# Altium project Thunderscope-E.PrjPCB
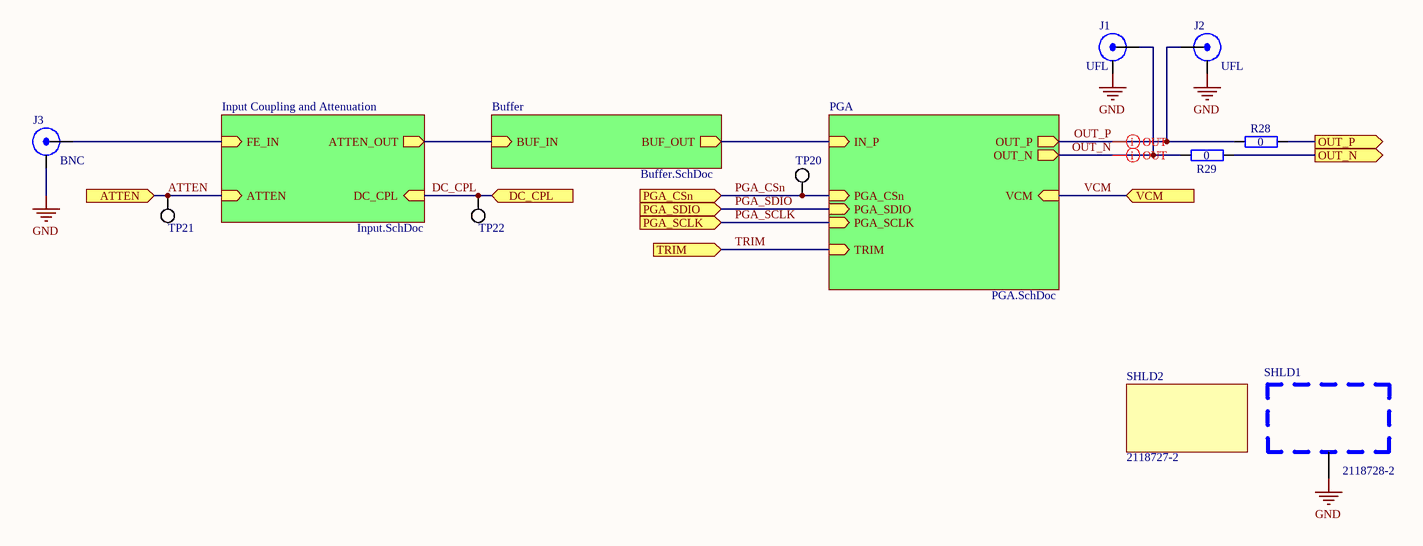
[diagram p0: FE_Channel.SchDoc]
Template Notes: - Nominal values used, dimensions in mm  - The mounting holes and keep-out areas around them are only required when the I/O bracket is mounted on the card directly  - Component height rule and clearance rule derived from PCI_Express_CEM_r2.0.pdf, Page 84.  - Stackup is not specified in PCI_Express_CEM_r2.0.pdf, nor implemented in this template.; Template Revision Date: Oct 29, 2010; Template Source Document: Outline:PCI_Express_CEM_r2.0.pdf  Pinout:PCI_Express_CEM_r2.0.pdf; Template Source Organization: PCI-SIG; Template Source Revision Date: R2.0, April 11, 2007; Template Source URL: http://www.pcisig.com
5 sheets, 138 parts. Net scope: hierarchical (ports join the sheet entries above them; power ports are global).
Board file: Thunderscope-E.PCBDOC
Sheets:
  FE_Channel.SchDoc
    Input Coupling and Attenuation = Input.SchDoc
    Buffer = Buffer.SchDoc
  ADC.SchDoc
  LEDs.SchDoc

## Sheet FE_Channel.SchDoc
size A4

### Parts
J1  UFL  [TE_2334884-1]
J2  UFL  [TE_2334884-1]
J3  BNC  [MOL_0731000105]
R28  0  [GEN_R_0402]
R29  0  [GEN_R_0402]
SHLD1  2118728-2  [TE_2118728-2]
SHLD2  2118727-2  (mechanical)
TP20  PCB  [GEN_TP_PCB]  (value not drawn)  (no BOM)
TP21  PCB  [GEN_TP_PCB]  (value not drawn)  (no BOM)
TP22  PCB  [GEN_TP_PCB]  (value not drawn)  (no BOM)

### Sub-sheets
Buffer = Buffer.SchDoc: BUF_IN (in), BUF_OUT (out)
Input Coupling and Attenuation = Input.SchDoc: ATTEN (in), FE_IN (in), ATTEN_OUT (out), DC_CPL (in)
PGA = PGA.SchDoc (file not in this document): IN_P (in), OUT_N (out), PGA_SDIO (in), OUT_P (out), VCM (in), PGA_SCLK (in), PGA_CSn (in), TRIM (in)

### Ports
ATTEN (in), DC_CPL (in), OUT_N (out), OUT_P (out), PGA_CSn (in), PGA_SCLK (in), PGA_SDIO (in), TRIM (in), VCM (in)

### Nets
GND: J1.2(SHIELD) J2.2(SHIELD) J3.2(SHIELD) SHLD1.1
ATTEN: TP21.1 ; port ATTEN, sheet Input Coupling and Attenuation/ATTEN
ATTEN_OUT: sheet Input Coupling and Attenuation/ATTEN_OUT, sheet Buffer/BUF_IN
BUF_OUT: sheet Buffer/BUF_OUT, sheet PGA/IN_P
DC_CPL: TP22.1 ; port DC_CPL, sheet Input Coupling and Attenuation/DC_CPL
FE_IN: J3.1(Signal) ; sheet Input Coupling and Attenuation/FE_IN
OUT_N: R29.2 ; port OUT_N
OUT_N: J1.1(Signal) R29.1 ; sheet PGA/OUT_N  [a separate net that carries the same name]
OUT_P: R28.2 ; port OUT_P
OUT_P: J2.1(Signal) R28.1 ; sheet PGA/OUT_P  [a separate net that carries the same name]
PGA_CSn: TP20.1 ; port PGA_CSn, sheet PGA/PGA_CSn
PGA_SCLK: port PGA_SCLK, sheet PGA/PGA_SCLK
PGA_SDIO: port PGA_SDIO, sheet PGA/PGA_SDIO
TRIM: port TRIM, sheet PGA/TRIM
VCM: port VCM, sheet PGA/VCM

### Layout directives
differential pair: OUT_N, OUT_P

### Library data of the parts
J1 J2 = UFL Jack SMD: Supplier 1: Digi-Key; Supplier Part Number 1: A145155CT-ND
J3 = BNC JACK R/A: Supplier 1: Digi-Key; Supplier Part Number 1: WM5524-ND
R28 R29 = RES 0 OHM 1/16W 0402: Power Rating: 0.0625W; Package: 0402; Supplier 1: Digi-Key; Supplier Part Number 1: 311-0.0JRCT-ND; Value: 0
SHLD1 = SHIELD 2118728-2: Supplier 1: Digi-Key; Supplier Part Number 1: A126158CT-ND
SHLD2 = SHIELD 2118727-2: Supplier 1: Digi-Key; Supplier Part Number 1: A126132-ND
TP20-TP22 = TP PCB 1mm

## Sheet Input.SchDoc
size A4
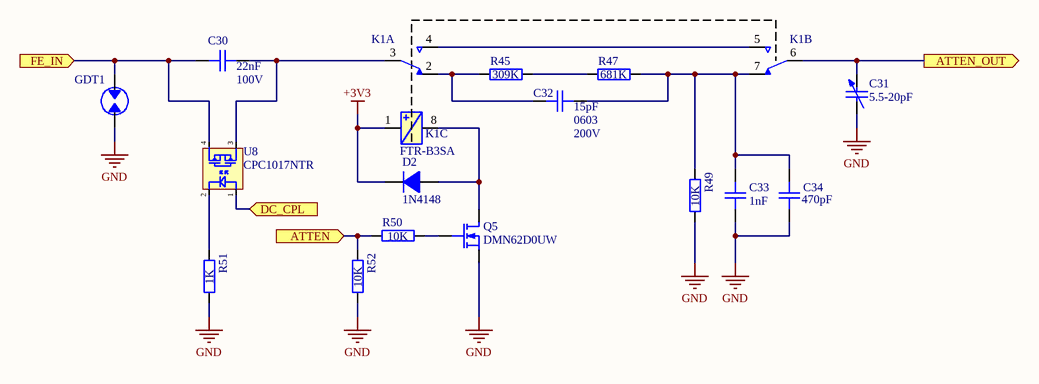
[diagram p1: Input.SchDoc]

### Parts
C30  22nF  Voltage Rating: 100V  [GEN_C_0603]
C31  5.5-20pF  [EW_TRIMCAP]
C32  15pF  Package: 0603  Voltage Rating: 200V  [GEN_C_0603]
C33  1nF  [GEN_C_0402]
C34  470pF  [GEN_C_0402]
D2  1N4148  [GEN_SOD_323]
GDT1  GDT  [BOU_2051]  (value not drawn)
K1  FTR-B3SA  [FUJ_FTR-B3SA]  (value not drawn)  (parts A,B,C of 3)
Q5  DMN62D0UW  [GEN_SOT_323]
R45  309K  [GEN_R_0402]
R47  681K  [GEN_R_0402]
R49  10K  [GEN_R_0402]
R50  10K  [GEN_R_0402]
R51  1K  [GEN_R_0402]
R52  10K  [GEN_R_0402]
U8  CPC1017NTR  [IXY_CPC1017]

### Ports
ATTEN (in), ATTEN_OUT (out), DC_CPL (in), FE_IN (in)

### Nets
+3V3: D2.1(K) K1.1
GND: C31.2 C33.1 C34.1 GDT1.2 Q5.3(S) R49.1 R51.1 R52.1
ATTEN: R50.2 R52.2 ; port ATTEN
ATTEN_OUT: C31.1 K1.6 ; port ATTEN_OUT
DC_CPL: U8.1 ; port DC_CPL
FE_IN: C30.2 GDT1.1 U8.4 ; port FE_IN
NetC30_1: C30.1 K1.3 U8.3
NetC32_1: C32.1 C33.2 C34.2 K1.7 R47.2 R49.2
NetC32_2: C32.2 K1.2 R45.1
NetD2_2: D2.2(A) K1.8 Q5.1(D)
NetK1_4: K1.4 K1.5
NetQ5_2: Q5.2(G) R50.1
NetR45_2: R45.2 R47.1
NetR51_2: R51.2 U8.2

### Library data of the parts
C30 = CAP 22nF 100V X7R 0603: Package: 0603; Supplier 1: Digi-Key; Supplier Part Number 1: 490-4782-1-ND; Value: 22nF
C31 = CAP TRIMMER 5.5-20PF 500V: Value: 5.5-20pF; Supplier 1: Digikey; Supplier Part Number 1: 2447-SGC3S200NMCT-ND
C32 = CAP 15pF 200V C0G 0603: Supplier 1: Digi-Key; Supplier Part Number 1: 478-10254-1-ND; Value: 15pF
C33 = CAP 1nF 50V C0G 0402: Voltage Rating: 50V; Package: 0402; Supplier 1: Digi-Key; Supplier Part Number 1: 490-6189-1-ND; Value: 1nF
C34 = CAP 470pF 50V C0G 0402: Voltage Rating: 50V; Temperature Coefficient: C0G; Package: 0402; Supplier 1: Digi-Key; Supplier Part Number 1: 490-8207-1-ND; Value: 470pF
D2 = DIODE 1N4148: Max Reverse Voltage: 75V; Max Current: 150mA; Supplier 1: Digi-Key; Supplier Part Number 1: 1N4148WS-FDICT-ND
GDT1 = GDT 90V: Supplier 1: Digi-Key; Supplier Part Number 1: 2051-09-SM-RPLFCT-ND
K1 = RELAY DPDT-NO FTR-B3SA: Supplier 1: Mouser; Supplier Part Number 1: 817-FTR-B3SA003Z
Q5 = NMOS DMN62D0UW: Vdss: 60V; Id: 340mA; Max Power: 320mW; Supplier 1: Digi-Key; Supplier Part Number 1: DMN62D0UW-7DICT-ND
R45 = RES 309K OHM 1% 1/16W 0402: Tolerance: 1%; Power Rating: 0.0625W; Package: 0402; Supplier 1: Digi-Key; Supplier Part Number 1: YAG3108CT-ND; Value: 309K
R47 = RES 681K OHM 1% 1/16W 0402: Tolerance: 1%; Power Rating: 0.0625W; Package: 0402; Supplier 1: Digi-Key; Supplier Part Number 1: YAG3212CT-ND; Value: 681K
R49 R50 R52 = RES 10K OHM 1% 1/10W 0402: Tolerance: 1%; Power Rating: 0.1W; Package: 0402; Supplier 1: Digi-Key; Supplier Part Number 1: P10.0KLCT-ND; Value: 10K
R51 = RES 1K OHM 1% 1/10W 0402: Tolerance: 1%; Power Rating: 0.1W; Package: 0402; Supplier 1: Digi-Key; Supplier Part Number 1: 311-1.00KLRCT-ND; Value: 1K
U8 = SSR CPC1017NTR: Supplier 1: Digi-Key; Supplier Part Number 1: CLA233CT-ND

## Sheet Buffer.SchDoc
size A4
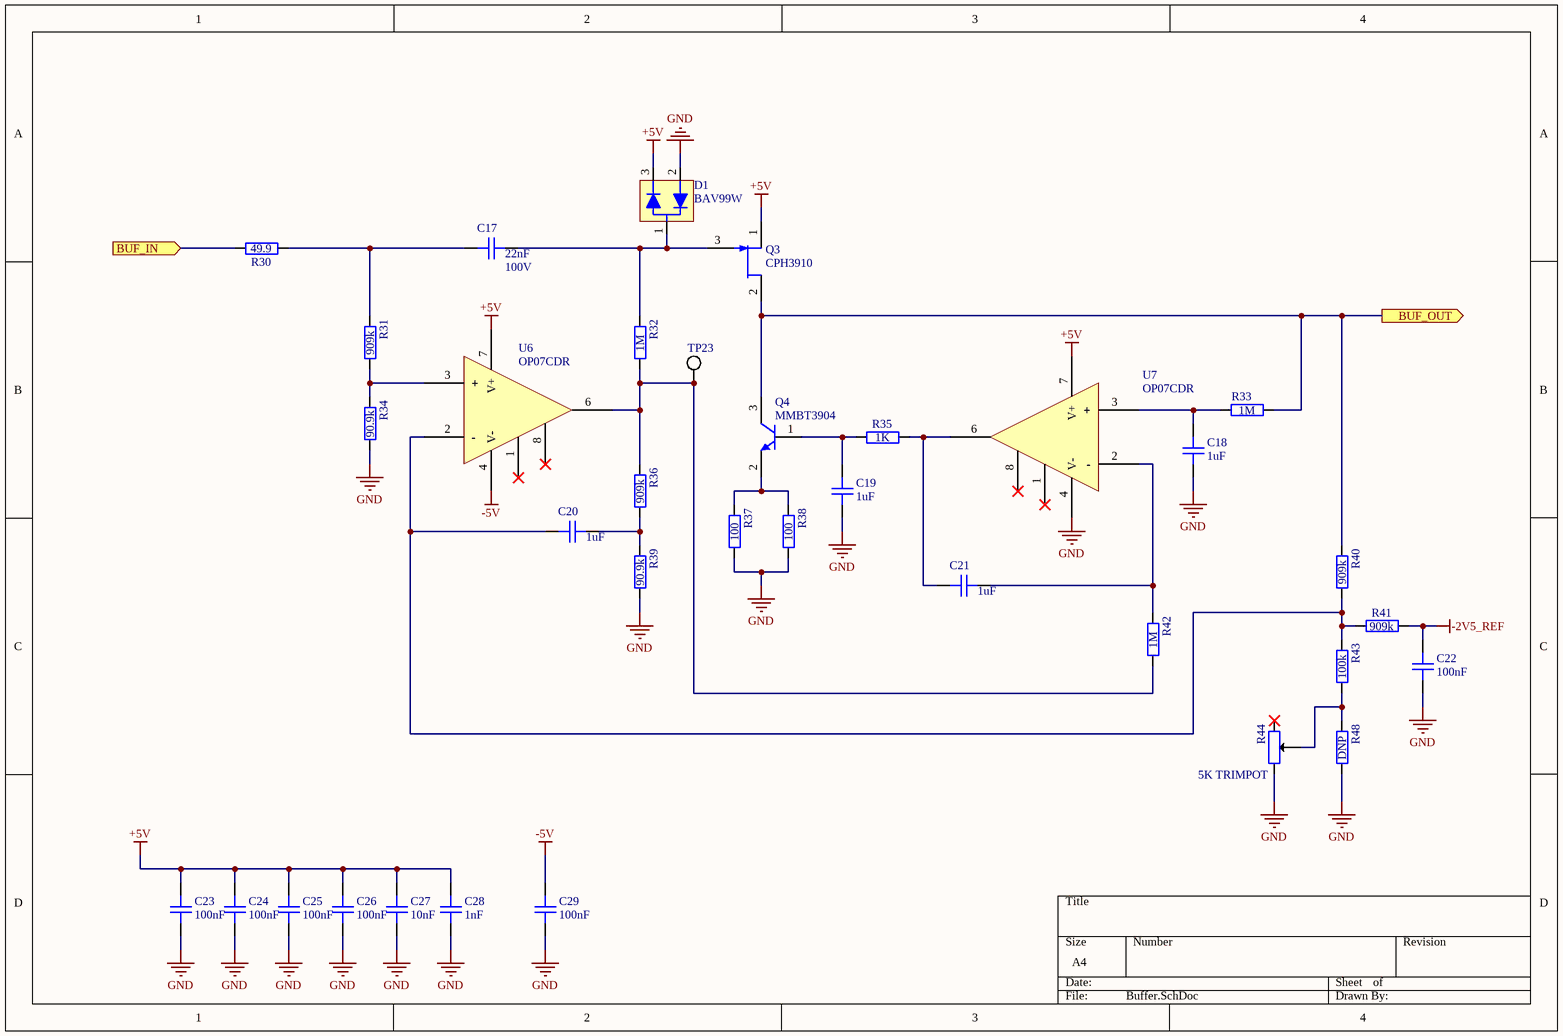
[diagram p2: Buffer.SchDoc]

### Parts
C17  22nF  Voltage Rating: 100V  [GEN_C_0603]
C18  1uF  [GEN_C_0402]
C19  1uF  [GEN_C_0402]
C20  1uF  [GEN_C_0402]
C21  1uF  [GEN_C_0402]
C22  100nF  [GEN_C_0402]
C23  100nF  [GEN_C_0402]
C24  100nF  [GEN_C_0402]
C25  100nF  [GEN_C_0402]
C26  100nF  [GEN_C_0402]
C27  10nF  [GEN_C_0402]
C28  1nF  [GEN_C_0402]
C29  100nF  [GEN_C_0402]
D1  BAV99W  [GEN_SOT_323]
Q3  CPH3910  [ON_SOT23_CPH3]
Q4  MMBT3904  [MMC_SOT23]
R30  49.9  [GEN_R_0402]
R31  909k  [GEN_R_0402]
R32  1M  [GEN_R_0402]
R33  1M  [GEN_R_0402]
R34  90.9k  [GEN_R_0402]
R35  1K  [GEN_R_0402]
R36  909k  [GEN_R_0402]
R37  100  [GEN_R_0402]
R38  100  [GEN_R_0402]
R39  90.9k  [GEN_R_0402]
R40  909k  [GEN_R_0402]
R41  909k  [GEN_R_0402]
R42  1M  [GEN_R_0402]
R43  100k  [GEN_R_0402]
R44  5K TRIMPOT  [BOU_3mm_POT]
R48  DNP  [GEN_R_0402]  (no BOM)
TP23  PCB  [GEN_TP_PCB]  (value not drawn)  (no BOM)
U6  OP07CDR  [TI_SOIC8_D0008A]
U7  OP07CDR  [TI_SOIC8_D0008A]

### Ports
BUF_IN (in), BUF_OUT (out)

### Nets
+5V: C23.1 C24.1 C25.1 C26.1 C27.2 C28.2 D1.3 Q3.1(S) U6.7(V+) U7.7(V+)
-2V5_REF: C22.1 R41.1
-5V: C29.1 U6.4(V-)
GND: C18.1 C19.1 C22.2 C23.2 C24.2 C25.2 C26.2 C27.1 C28.1 C29.2 D1.2 R34.1 R37.1 R38.1 R39.1 R44.3 R48.1 U7.4(V-)
ATTEN_OUT: R30.1 ; port BUF_IN
BUF_OUT: Q3.2(D) Q4.3(C) R33.1 R40.2 ; port BUF_OUT
NetC17_1: C17.1 D1.1 Q3.3(G) R32.2
NetC17_2: C17.2 R30.2 R31.2
NetC18_2: C18.2 R33.2 U7.3(+)
NetC19_2: C19.2 Q4.1(B) R35.1
NetC20_1: C20.1 R36.1 R39.2
NetC20_2: C20.2 R40.1 R41.2 R43.2 U6.2(-)
NetC21_1: C21.1 R42.2 U7.2(-)
NetC21_2: C21.2 R35.2 U7.6(OUT)
NetQ4_2: Q4.2(E) R37.2 R38.2
NetR31_1: R31.1 R34.2 U6.3(+)
NetR32_1: R32.1 R36.2 R42.1 TP23.1 U6.6(OUT)
NetR43_1: R43.1 R44.2 R48.2

Not connected (* = marked no-connect by the designer): R44 1*; U6 1(N1)* 8(N2)*; U7 1(N1)* 8(N2)*

### Library data of the parts
C17 = CAP 22nF 100V X7R 0603: Package: 0603; Value: 22nF; Supplier 1: Digi-Key; Supplier Part Number 1: 490-4782-1-ND
C18-C21 = CAP 1uF 25V X5R 0402: Voltage Rating: 25V; Package: 0402; Supplier 1: Digi-Key; Supplier Part Number 1: 490-10017-1-ND; Value: 1uF
C22-C26 C29 = CAP 100nF 16V X7R 0402: Voltage Rating: 16V; Package: 0402; Supplier 1: Digi-Key; Supplier Part Number 1: 490-4759-1-ND; Value: 100nF
C27 = CAP 10nF 50V X7R 0402: Voltage Rating: 50V; Package: 0402; Supplier 1: Digi-Key; Supplier Part Number 1: 490-6351-1-ND; Value: 10nF
C28 = CAP 1nF 50V C0G 0402: Voltage Rating: 50V; Package: 0402; Supplier 1: Digi-Key; Supplier Part Number 1: 490-6189-1-ND; Value: 1nF
D1 = DIODE ARRAY BAV99W: Supplier 1: Digi-Key; Supplier Part Number 1: BAV99W-FDICT-ND
Q3 = NJFET CPH3910: Supplier 1: Digi-Key; Supplier Part Number 1: CPH3910-TL-EOSCT-ND
Q4 = NPN MMBT3904: Supplier 1: Digi-Key; Supplier Part Number 1: MMBT3904TPMSCT-ND
R30 = RES 49.9 OHM 1% 1/10W 0402: Tolerance: 1%; Power Rating: 0.1W; Package: 0402; Supplier 1: Digi-Key; Supplier Part Number 1: 311-49.9LRCT-ND; Value: 49.9
R31 R36 R40 R41 = RES 909K OHM 1% 1/16W 0402: Tolerance: 1%; Power Rating: 0.0625W; Package: 0402; Supplier 1: Digi-Key; Supplier Part Number 1: YAG2377CT-ND; Value: 909k
R32 R33 R42 = RES 1M OHM 1% 1/10W 0402: Tolerance: 1%; Power Rating: 0.1W; Package: 0402; Supplier 1: Digi-Key; Supplier Part Number 1: P1.00MLCT-ND; Value: 1M
R34 R39 = RES 90.9K OHM 1% 1/16W 0402: Tolerance: 1%; Power Rating: 0.0625W; Package: 0402; Supplier 1: Digi-Key; Supplier Part Number 1: 311-90.9KLRCT-ND; Value: 90.9k
R35 = RES 1K OHM 1% 1/10W 0402: Tolerance: 1%; Power Rating: 0.1W; Package: 0402; Supplier 1: Digi-Key; Supplier Part Number 1: 311-1.00KLRCT-ND; Value: 1K
R37 R38 = RES 100 OHM 1% 1/10W 0402: Tolerance: 1%; Power Rating: 0.1W; Package: 0402; Supplier 1: Digi-Key; Supplier Part Number 1: 2019-RK73H1ETTP1000FCT-ND; Value: 100
R43 = RES 100K OHM 1% 1/10W 0402: Tolerance: 1%; Power Rating: 0.1W; Package: 0402; Supplier 1: Digi-Key; Supplier Part Number 1: 311-100KLRCT-ND; Value: 100k
R44 = TRIMMER 5K OHM 0.1W J LEAD TOP: Tolerance: 1%; Power Rating: 0.1W; Supplier 1: Digi-Key; Supplier Part Number 1: TC33X-502ECT-ND; Value: 5K
R48 = RES DNP 0402: Tolerance: 1%; Power Rating: 0.0625W; Package: 0402; Value: DNP
TP23 = TP PCB 1mm
U6 U7 = IC OPAMP OP07CDR: Supplier 1: Digi-Key; Supplier Part Number 1: 296-14626-1-ND

## Sheet ADC.SchDoc
size A4
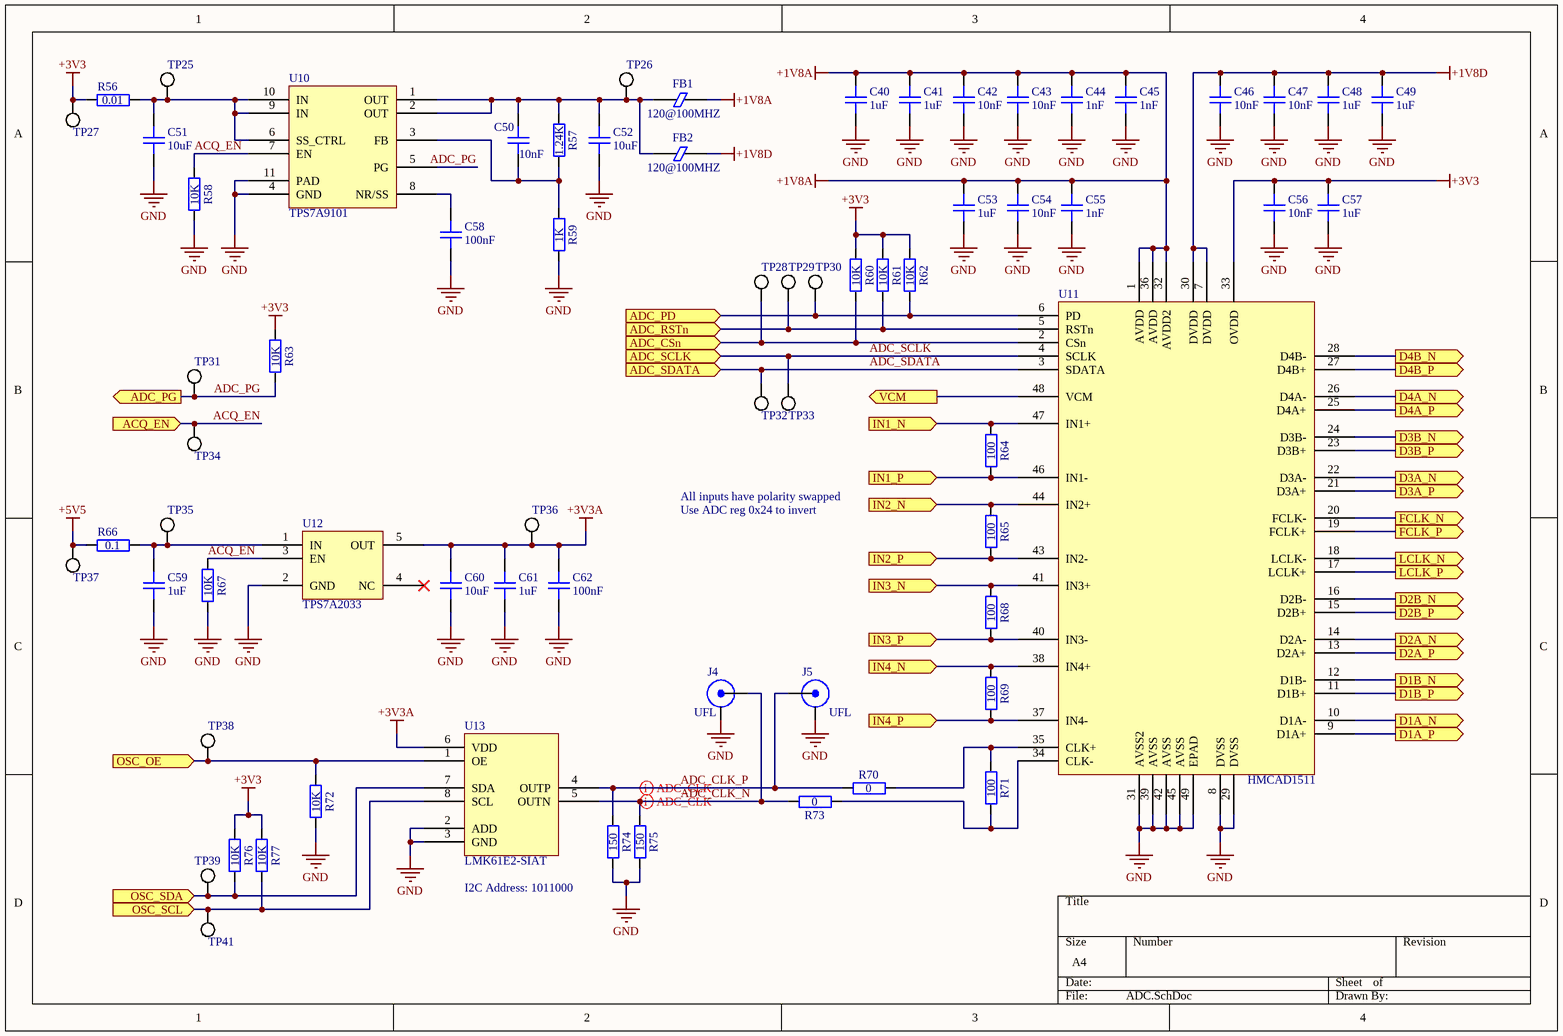
[diagram p3: ADC.SchDoc]

### Parts
C40  1uF  [GEN_C_0402]
C41  1uF  [GEN_C_0402]
C42  10nF  [GEN_C_0402]
C43  10nF  [GEN_C_0402]
C44  1nF  [GEN_C_0402]
C45  1nF  [GEN_C_0402]
C46  10nF  [GEN_C_0402]
C47  10nF  [GEN_C_0402]
C48  1uF  [GEN_C_0402]
C49  1uF  [GEN_C_0402]
C50  10nF  [GEN_C_0402]
C51  10uF  [GEN_C_0603]
C52  10uF  [GEN_C_0603]
C53  1uF  [GEN_C_0402]
C54  10nF  [GEN_C_0402]
C55  1nF  [GEN_C_0402]
C56  10nF  [GEN_C_0402]
C57  1uF  [GEN_C_0402]
C58  100nF  [GEN_C_0402]
C59  1uF  [GEN_C_0402]
C60  10uF  [GEN_C_0603]
C61  1uF  [GEN_C_0402]
C62  100nF  [GEN_C_0402]
FB1  120@100MHZ  [GEN_R_0402]
FB2  120@100MHZ  [GEN_R_0402]
J4  UFL  [TE_2334884-1]
J5  UFL  [TE_2334884-1]
R56  0.01  [GEN_R_0603]
R57  1.24K  [GEN_R_0402]
R58  10K  [GEN_R_0402]
R59  1K  [GEN_R_0402]
R60  10K  [GEN_R_0402]
R61  10K  [GEN_R_0402]
R62  10K  [GEN_R_0402]
R63  10K  [GEN_R_0402]
R64  100  [GEN_R_0402]
R65  100  [GEN_R_0402]
R66  0.1  [GEN_R_0402]
R67  10K  [GEN_R_0402]
R68  100  [GEN_R_0402]
R69  100  [GEN_R_0402]
R70  0  [GEN_R_0402]
R71  100  [GEN_R_0402]
R72  10K  [GEN_R_0402]
R73  0  [GEN_R_0402]
R74  150  [GEN_R_0402]
R75  150  [GEN_R_0402]
R76  10K  [GEN_R_0402]
R77  10K  [GEN_R_0402]
TP25  PCB  [GEN_TP_PCB]  (value not drawn)  (no BOM)
TP26  PCB  [GEN_TP_PCB]  (value not drawn)  (no BOM)
TP27  PCB  [GEN_TP_PCB]  (value not drawn)  (no BOM)
TP28  PCB  [GEN_TP_PCB]  (value not drawn)  (no BOM)
TP29  PCB  [GEN_TP_PCB]  (value not drawn)  (no BOM)
TP30  PCB  [GEN_TP_PCB]  (value not drawn)  (no BOM)
TP31  PCB  [GEN_TP_PCB]  (value not drawn)  (no BOM)
TP32  PCB  [GEN_TP_PCB]  (value not drawn)  (no BOM)
TP33  PCB  [GEN_TP_PCB]  (value not drawn)  (no BOM)
TP34  PCB  [GEN_TP_PCB]  (value not drawn)  (no BOM)
TP35  PCB  [GEN_TP_PCB]  (value not drawn)  (no BOM)
TP36  PCB  [GEN_TP_PCB]  (value not drawn)  (no BOM)
TP37  PCB  [GEN_TP_PCB]  (value not drawn)  (no BOM)
TP38  PCB  [GEN_TP_PCB]  (value not drawn)  (no BOM)
TP39  PCB  [GEN_TP_PCB]  (value not drawn)  (no BOM)
TP41  PCB  [GEN_TP_PCB]  (value not drawn)  (no BOM)
U10  TPS7A9101  [TI_WSON10_DSK0010A]
U11  HMCAD1511  [AD_QFN48_LP7]
U12  TPS7A2033  [GEN_SOT23_5_950_2900X1600X1450]
U13  LMK61E2-SIAT  [TI_QFM8_SIA0008B]

### Ports
ACQ_EN (in), ADC_CSn (in), ADC_PD (in), ADC_PG (out), ADC_RSTn (in), ADC_SCLK (in), ADC_SDATA (in), D1A_N (out), D1A_P (out), D1B_N (out), D1B_P (out), D2A_N (out), D2A_P (out), D2B_N (out), D2B_P (out), D3A_N (out), D3A_P (out), D3B_N (out), D3B_P (out), D4A_N (out), D4A_P (out), D4B_N (out), D4B_P (out), FCLK_N (out), FCLK_P (out), IN1_N (in), IN1_P (in), IN2_N (in), IN2_P (in), IN3_N (in), IN3_P (in), IN4_N (in), IN4_P (in), LCLK_N (out), LCLK_P (out), OSC_OE (in), OSC_SCL (in), OSC_SDA (in), VCM (out)

### Nets
+1V8A: C40.2 C41.2 C42.2 C43.2 C44.2 C45.2 C53.2 C54.2 C55.2 FB1.2 U11.1(AVDD) U11.32(AVDD2) U11.36(AVDD)
+1V8D: C46.2 C47.2 C48.2 C49.2 FB2.2 U11.7(DVDD) U11.30(DVDD)
+3V3: C56.2 C57.2 R56.1 R60.2 R61.2 R62.2 R63.2 R76.2 R77.2 TP27.1 U11.33(OVDD)
+3V3A: C60.2 C61.2 C62.2 TP36.1 U12.5(OUT) U13.6(VDD)
+5V5: R66.1 TP37.1
GND: C40.1 C41.1 C42.1 C43.1 C44.1 C45.1 C46.1 C47.1 C48.1 C49.1 C51.1 C52.1 C53.1 C54.1 C55.1 C56.1 C57.1 C58.1 C59.1 C60.1 C61.1 C62.1 J4.2(SHIELD) J5.2(SHIELD) R58.1 R59.1 R67.1 R72.1 R74.1 R75.1 U10.4(GND) U10.11(PAD) U11.8(DVSS) U11.29(DVSS) U11.31(AVSS2) U11.39(AVSS) U11.42(AVSS) U11.45(AVSS) U11.49(EPAD) U12.2(GND) U13.2(ADD) U13.3(GND)
ACQ_EN: R58.2 R67.2 TP34.1 U10.7(EN) U12.3(EN) ; port ACQ_EN
ADC_CLK_N: J4.1(Signal) R73.1 R75.2 U13.5(OUTN)
ADC_CLK_P: J5.1(Signal) R70.1 R74.2 U13.4(OUTP)
ADC_CSn: R60.1 TP28.1 U11.2(CSn) ; port ADC_CSn
ADC_PD: R62.1 TP30.1 U11.6(PD) ; port ADC_PD
ADC_PG: R63.1 TP31.1 U10.5(PG) ; port ADC_PG
ADC_RSTn: R61.1 TP29.1 U11.5(RSTn) ; port ADC_RSTn
ADC_SCLK: TP33.1 U11.4(SCLK) ; port ADC_SCLK
ADC_SDATA: TP32.1 U11.3(SDATA) ; port ADC_SDATA
D1A_N: U11.10(D1A-) ; port D1A_N
D1A_P: U11.9(D1A+) ; port D1A_P
D1B_N: U11.12(D1B-) ; port D1B_N
D1B_P: U11.11(D1B+) ; port D1B_P
D2A_N: U11.14(D2A-) ; port D2A_N
D2A_P: U11.13(D2A+) ; port D2A_P
D2B_N: U11.16(D2B-) ; port D2B_N
D2B_P: U11.15(D2B+) ; port D2B_P
D3A_N: U11.22(D3A-) ; port D3A_N
D3A_P: U11.21(D3A+) ; port D3A_P
D3B_N: U11.24(D3B-) ; port D3B_N
D3B_P: U11.23(D3B+) ; port D3B_P
D4A_N: U11.26(D4A-) ; port D4A_N
D4A_P: U11.25(D4A+) ; port D4A_P
D4B_N: U11.28(D4B-) ; port D4B_N
D4B_P: U11.27(D4B+) ; port D4B_P
FCLK_N: U11.20(FCLK-) ; port FCLK_N
FCLK_P: U11.19(FCLK+) ; port FCLK_P
IN1_N: R64.2 U11.47(IN1+) ; port IN1_N
IN1_P: R64.1 U11.46(IN1-) ; port IN1_P
IN2_N: R65.2 U11.44(IN2+) ; port IN2_N
IN2_P: R65.1 U11.43(IN2-) ; port IN2_P
IN3_N: R68.2 U11.41(IN3+) ; port IN3_N
IN3_P: R68.1 U11.40(IN3-) ; port IN3_P
IN4_N: R69.2 U11.38(IN4+) ; port IN4_N
IN4_P: R69.1 U11.37(IN4-) ; port IN4_P
LCLK_N: U11.18(LCLK-) ; port LCLK_N
LCLK_P: U11.17(LCLK+) ; port LCLK_P
OSC_OE: R72.2 TP38.1 U13.1(OE) ; port OSC_OE
OSC_SCL: R77.1 TP41.1 U13.8(SCL) ; port OSC_SCL
OSC_SDA: R76.1 TP39.1 U13.7(SDA) ; port OSC_SDA
VCM: U11.48(VCM) ; port VCM
NetC50_1: C50.1 R57.1 R59.2 U10.3(FB)
NetC50_2: C50.2 C52.2 FB1.1 FB2.1 R57.2 TP26.1 U10.1(OUT) U10.2(OUT)
NetC51_2: C51.2 R56.2 TP25.1 U10.6(SS_CTRL) U10.9(IN) U10.10(IN)
NetC58_2: C58.2 U10.8(NR/SS)
NetC59_2: C59.2 R66.2 TP35.1 U12.1(IN)
NetR70_2: R70.2 R71.2 U11.35(CLK+)
NetR71_1: R71.1 R73.2 U11.34(CLK-)

Not connected (* = marked no-connect by the designer): U12 4(NC)*

### Layout directives
differential pair: ADC_CLK_N, ADC_CLK_P

### Notes on the sheet
- All inputs have polarity swapped
- Use ADC reg 0x24 to invert
- I2C Address: 1011000

### Library data of the parts
C40 C41 C48 C49 C53 C57 C59 C61 = CAP 1uF 25V X5R 0402: Voltage Rating: 25V; Package: 0402; Supplier 1: Digi-Key; Supplier Part Number 1: 490-10017-1-ND; Value: 1uF
C42 C43 C46 C47 C50 C54 C56 = CAP 10nF 50V X7R 0402: Voltage Rating: 50V; Package: 0402; Supplier 1: Digi-Key; Supplier Part Number 1: 490-6351-1-ND; Value: 10nF
C44 C45 C55 = CAP 1nF 50V C0G 0402: Voltage Rating: 50V; Package: 0402; Supplier 1: Digi-Key; Supplier Part Number 1: 490-6189-1-ND; Value: 1nF
C51 C52 C60 = CAP 10uF 10V X5R 0603: Voltage Rating: 10V; Package: 0402; Supplier 1: Digi-Key; Supplier Part Number 1: 490-10474-1-ND; Value: 10uF
C58 C62 = CAP 100nF 16V X7R 0402: Voltage Rating: 16V; Package: 0402; Supplier 1: Digi-Key; Supplier Part Number 1: 490-4759-1-ND; Value: 100nF
FB1 FB2 = FERRITE BEAD 120 OHM 0402: Supplier 1: Digi-Key; Supplier Part Number 1: 490-9656-1-ND
J4 J5 = UFL Jack SMD: Supplier 1: Digi-Key; Supplier Part Number 1: A145155CT-ND
R56 = RES 0.01 OHM 1% 1/4W 0603: Tolerance: 1%; Power Rating: 0.25W; Supplier 1: Digi-Key; Supplier Part Number 1: 408-1404-1-ND; Value: 0.01; Package: 0603
R57 = RES 1.24K OHM 1% 1/16W 0402: Tolerance: 1%; Power Rating: 0.0625W; Package: 0402; Value: 1.24K; Supplier 1: Digi-Key; Supplier Part Number 1: 311-1.24KLRCT-ND
R58 R60-R63 R67 R72 R76 R77 = RES 10K OHM 1% 1/10W 0402: Tolerance: 1%; Power Rating: 0.1W; Package: 0402; Supplier 1: Digi-Key; Supplier Part Number 1: P10.0KLCT-ND; Value: 10K
R59 = RES 1K OHM 1% 1/10W 0402: Tolerance: 1%; Power Rating: 0.1W; Package: 0402; Supplier 1: Digi-Key; Supplier Part Number 1: 311-1.00KLRCT-ND; Value: 1K
R64 R65 R68 R69 R71 = RES 100 OHM 1% 1/10W 0402: Tolerance: 1%; Power Rating: 0.1W; Package: 0402; Value: 100; Supplier 1: Digi-Key; Supplier Part Number 1: 2019-RK73H1ETTP1000FCT-ND
R66 = RES 0.1 OHM 1% 1/6W 0402: Tolerance: 1%; Power Rating: 0.16W; Package: 0402; Supplier 1: Digi-Key; Supplier Part Number 1: P.10AKCT-ND; Value: 0.1
R70 R73 = RES 0 OHM 1/16W 0402: Power Rating: 0.0625W; Package: 0402; Supplier 1: Digi-Key; Supplier Part Number 1: 311-0.0JRCT-ND; Value: 0
R74 R75 = RES 150 OHM 1% 1/16W 0402: Tolerance: 1%; Power Rating: 0.0625W; Package: 0402; Value: 150; Supplier 1: Digi-Key; Supplier Part Number 1: 311-150LRCT-ND
TP25-TP39 TP41 = TP PCB 1mm
U10 = IC LDO TPS7A9101: Supplier 1: Digi-Key; Supplier Part Number 1: 296-45298-1-ND
U11 = IC ADC HMCAD1511: Supplier 1: Digi-Key; Supplier Part Number 1: 1127-1648-ND
U12 = IC LDO TPS7A2033: Supplier 1: Digi-Key; Supplier Part Number 1: 296-TPS7A2033PDBVRCT-ND
U13 = IC PROG OSC LMK61E2-SIAT: Supplier 1: Digi-Key; Supplier Part Number 1: 296-43212-1-ND

## Sheet LEDs.SchDoc
size A4
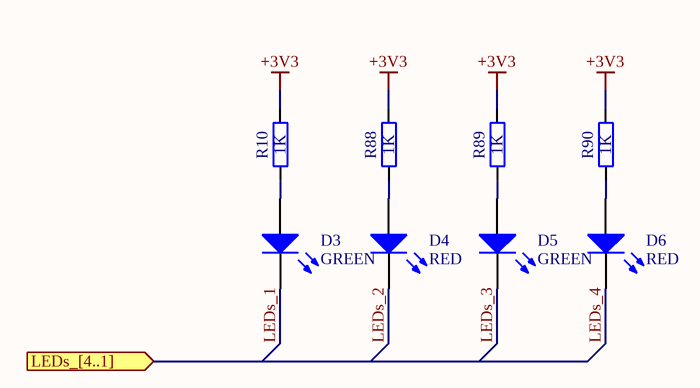
[diagram p4: LEDs.SchDoc]

### Parts
D3  GREEN  [LED_0603_APT1608]
D4  RED  [LED_0603_APT1608]
D5  GREEN  [LED_0603_APT1608]
D6  RED  [LED_0603_APT1608]
R10  1K  [GEN_R_0402]
R88  1K  [GEN_R_0402]
R89  1K  [GEN_R_0402]
R90  1K  [GEN_R_0402]

### Ports
LEDs_[4..1] (in)

### Nets
+3V3: R10.2 R88.2 R89.2 R90.2
LEDs_1: D3.1(K)
LEDs_2: D4.1(K)
LEDs_3: D5.1(K)
LEDs_4: D6.1(K)
NetD3_2: D3.2(A) R10.1
NetD4_2: D4.2(A) R88.1
NetD5_2: D5.2(A) R89.1
NetD6_2: D6.2(A) R90.1

### Library data of the parts
D3 D5 = LED GREEN 0603 APT1608: Supplier 1: Digi-Key; Supplier Part Number 1: 754-1934-1-ND
D4 D6 = LED RED 0603 APT1608: Supplier 1: Digi-Key; Supplier Part Number 1: 754-1930-1-ND
R10 R88-R90 = RES 1K OHM 1% 1/10W 0402: Tolerance: 1%; Power Rating: 0.1W; Package: 0402; Supplier 1: Digi-Key; Supplier Part Number 1: 311-1.00KLRCT-ND; Value: 1K

## Nets that join several sheets
+3V3: Input (D2.1 K1.1), ADC (11 pins), LEDs (R10.2 R88.2 R89.2 R90.2)
GND: FE_Channel (J1.2 J2.2 J3.2 SHLD1.1), Input (8 pins), Buffer (18 pins), ADC (42 pins)
ATTEN: FE_Channel (TP21.1), Input (R50.2 R52.2)
ATTEN_OUT: Input (C31.1 K1.6), Buffer (R30.1)
DC_CPL: FE_Channel (TP22.1), Input (U8.1)
FE_IN: FE_Channel (J3.1), Input (C30.2 GDT1.1 U8.4)